# EAGLE schematic schematic3 (EAGLE 7.6.0)
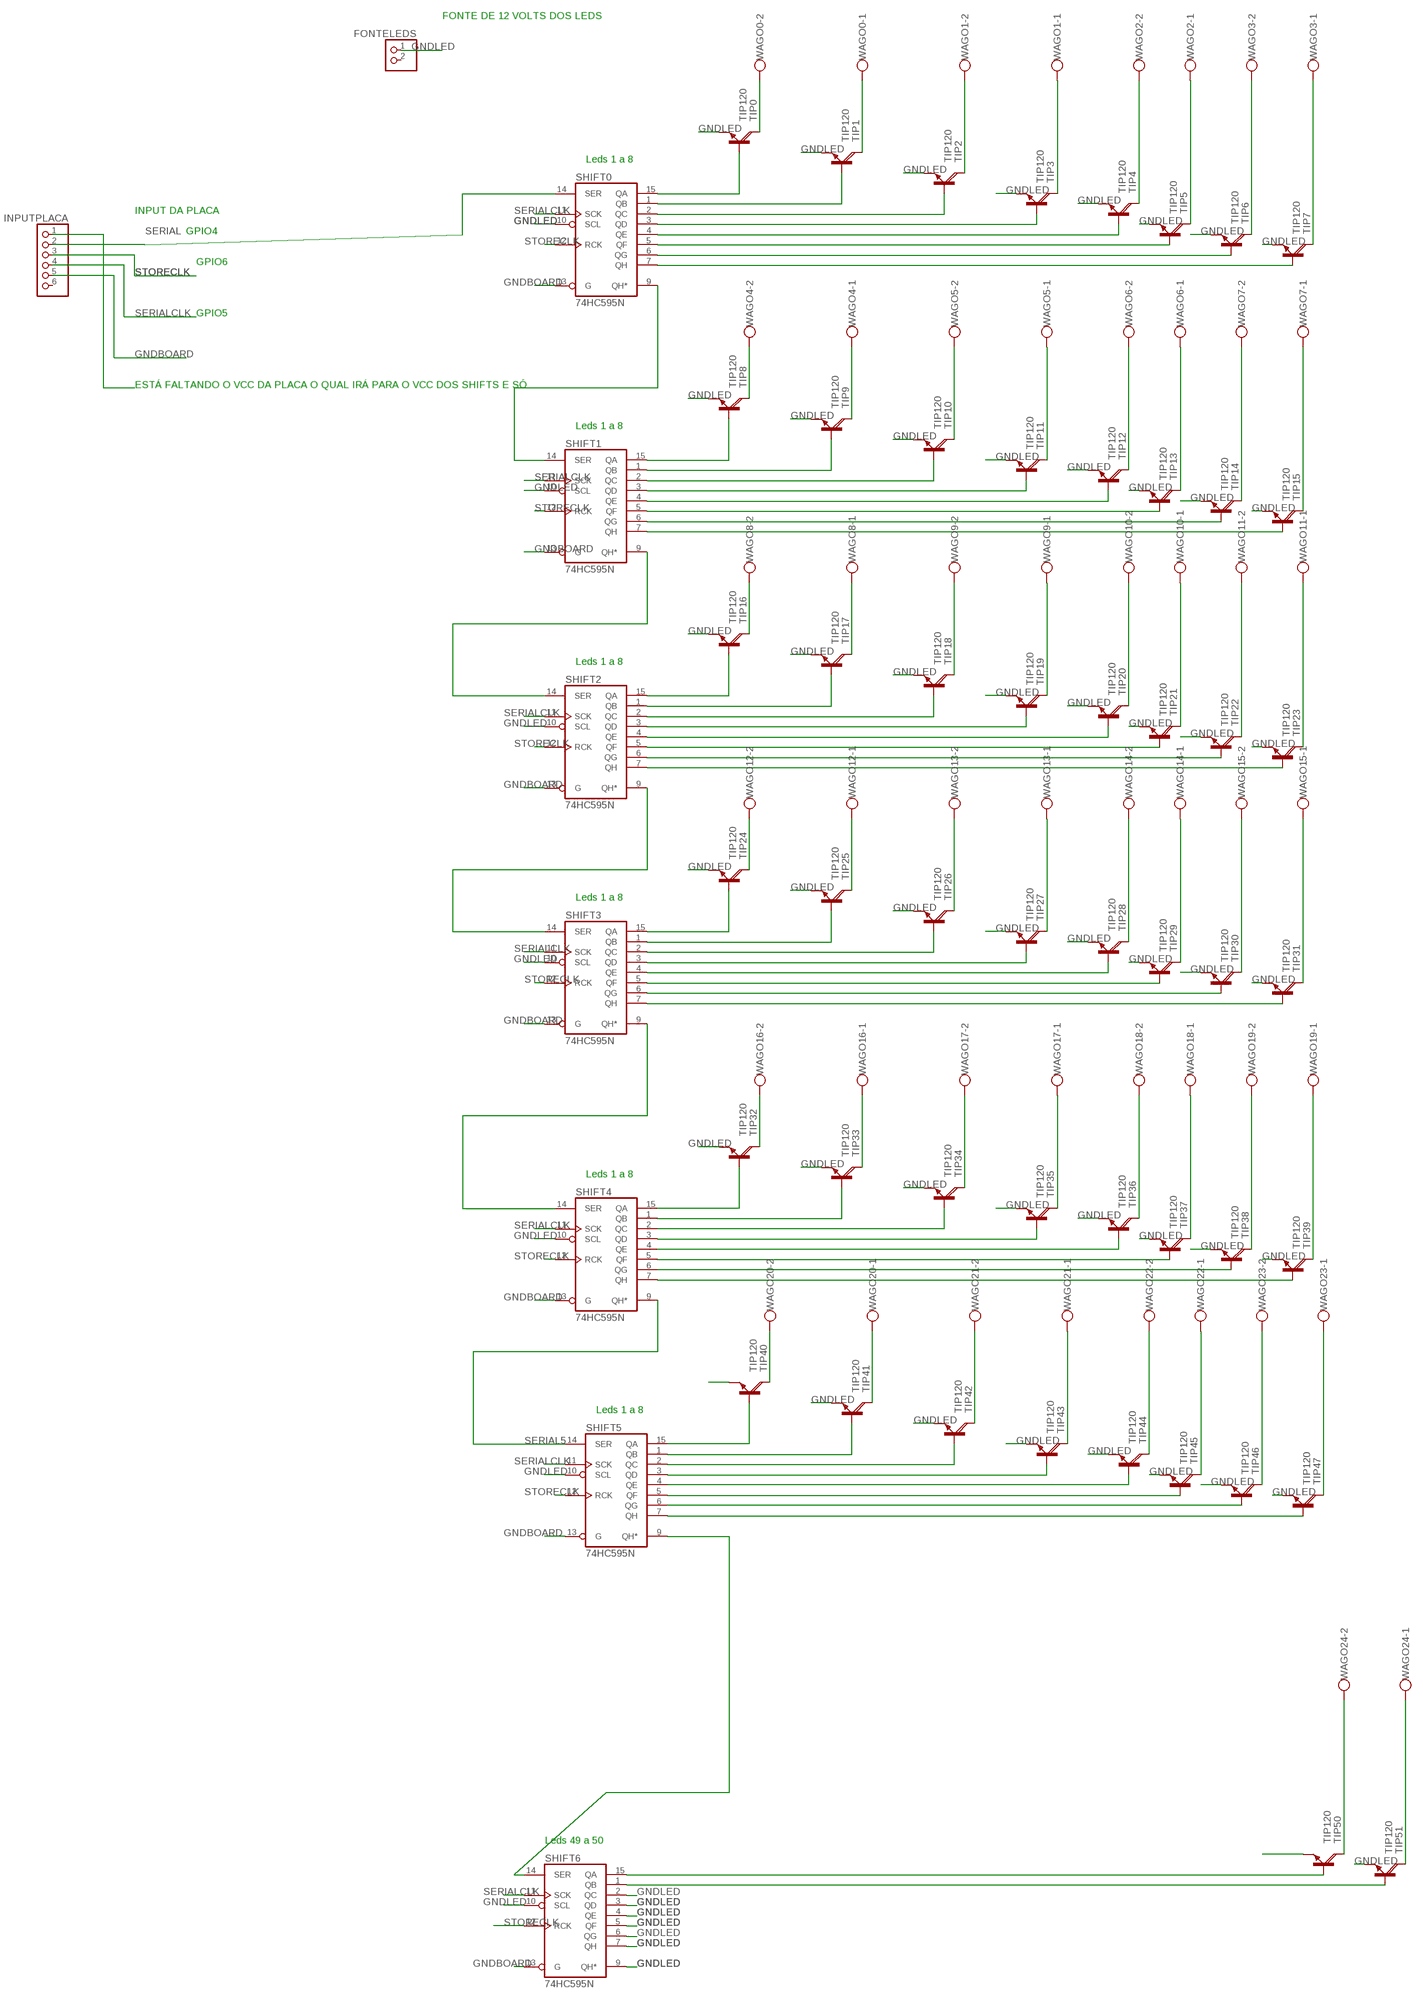
[diagram p0: schematic, sheet 1]

## Parts
FONTELEDS  PINHD-1X2  [1X02]
INPUTPLACA  PINHD-1X6  [1X06]
SHIFT0  74HC595N  [DIL16]
SHIFT1  74HC595N  [DIL16]
SHIFT2  74HC595N  [DIL16]
SHIFT3  74HC595N  [DIL16]
SHIFT4  74HC595N  [DIL16]
SHIFT5  74HC595N  [DIL16]
SHIFT6  74HC595N  [DIL16]
TIP0  TIP120  [TO220AH]
TIP1  TIP120  [TO220AH]
TIP2  TIP120  [TO220AH]
TIP3  TIP120  [TO220AH]
TIP4  TIP120  [TO220AH]
TIP5  TIP120  [TO220AH]
TIP6  TIP120  [TO220AH]
TIP7  TIP120  [TO220AH]
TIP8  TIP120  [TO220AH]
TIP9  TIP120  [TO220AH]
TIP10  TIP120  [TO220AH]
TIP11  TIP120  [TO220AH]
TIP12  TIP120  [TO220AH]
TIP13  TIP120  [TO220AH]
TIP14  TIP120  [TO220AH]
TIP15  TIP120  [TO220AH]
TIP16  TIP120  [TO220AH]
TIP17  TIP120  [TO220AH]
TIP18  TIP120  [TO220AH]
TIP19  TIP120  [TO220AH]
TIP20  TIP120  [TO220AH]
TIP21  TIP120  [TO220AH]
TIP22  TIP120  [TO220AH]
TIP23  TIP120  [TO220AH]
TIP24  TIP120  [TO220AH]
TIP25  TIP120  [TO220AH]
TIP26  TIP120  [TO220AH]
TIP27  TIP120  [TO220AH]
TIP28  TIP120  [TO220AH]
TIP29  TIP120  [TO220AH]
TIP30  TIP120  [TO220AH]
TIP31  TIP120  [TO220AH]
TIP32  TIP120  [TO220AH]
TIP33  TIP120  [TO220AH]
TIP34  TIP120  [TO220AH]
TIP35  TIP120  [TO220AH]
TIP36  TIP120  [TO220AH]
TIP37  TIP120  [TO220AH]
TIP38  TIP120  [TO220AH]
TIP39  TIP120  [TO220AH]
TIP40  TIP120  [TO220AH]
TIP41  TIP120  [TO220AH]
TIP42  TIP120  [TO220AH]
TIP43  TIP120  [TO220AH]
TIP44  TIP120  [TO220AH]
TIP45  TIP120  [TO220AH]
TIP46  TIP120  [TO220AH]
TIP47  TIP120  [TO220AH]
TIP50  TIP120  [TO220AH]
TIP51  TIP120  [TO220AH]
WAGO0  W237-102  [W237-102]
WAGO1  W237-102  [W237-102]
WAGO2  W237-102  [W237-102]
WAGO3  W237-102  [W237-102]
WAGO4  W237-102  [W237-102]
WAGO5  W237-102  [W237-102]
WAGO6  W237-102  [W237-102]
WAGO7  W237-102  [W237-102]
WAGO8  W237-102  [W237-102]
WAGO9  W237-102  [W237-102]
WAGO10  W237-102  [W237-102]
WAGO11  W237-102  [W237-102]
WAGO12  W237-102  [W237-102]
WAGO13  W237-102  [W237-102]
WAGO14  W237-102  [W237-102]
WAGO15  W237-102  [W237-102]
WAGO16  W237-102  [W237-102]
WAGO17  W237-102  [W237-102]
WAGO18  W237-102  [W237-102]
WAGO19  W237-102  [W237-102]
WAGO20  W237-102  [W237-102]
WAGO21  W237-102  [W237-102]
WAGO22  W237-102  [W237-102]
WAGO23  W237-102  [W237-102]
WAGO24  W237-102  [W237-102]

## Nets
GNDBOARD: INPUTPLACA.5 SHIFT0.13(G) SHIFT1.13(G) SHIFT2.13(G) SHIFT3.13(G) SHIFT4.13(G) SHIFT5.13(G) SHIFT6.13(G)
GNDLED: FONTELEDS.1 SHIFT0.10(SCL) SHIFT1.10(SCL) SHIFT2.10(SCL) SHIFT3.10(SCL) SHIFT4.10(SCL) SHIFT5.10(SCL) SHIFT6.2(QC) SHIFT6.3(QD) SHIFT6.4(QE) SHIFT6.5(QF) SHIFT6.6(QG) SHIFT6.7(QH) SHIFT6.9(QH*) SHIFT6.10(SCL) TIP0.E TIP1.E TIP2.E TIP3.E TIP4.E TIP5.E TIP6.E TIP7.E TIP8.E TIP9.E TIP10.E TIP11.E TIP12.E TIP13.E TIP14.E TIP15.E TIP16.E TIP17.E TIP18.E TIP19.E TIP20.E TIP21.E TIP22.E TIP23.E TIP24.E TIP25.E TIP26.E TIP27.E TIP28.E TIP29.E TIP30.E TIP31.E TIP32.E TIP33.E TIP34.E TIP35.E TIP36.E TIP37.E TIP38.E TIP39.E TIP40.E TIP41.E TIP42.E TIP43.E TIP44.E TIP45.E TIP46.E TIP47.E TIP50.E TIP51.E
N$1: SHIFT0.15(QA) TIP0.B
N$2: SHIFT0.1(QB) TIP1.B
N$3: SHIFT0.2(QC) TIP2.B
N$4: SHIFT0.3(QD) TIP3.B
N$5: SHIFT0.4(QE) TIP4.B
N$6: SHIFT0.5(QF) TIP5.B
N$7: SHIFT0.6(QG) TIP6.B
N$8: SHIFT0.7(QH) TIP7.B
N$9: SHIFT1.15(QA) TIP8.B
N$10: SHIFT1.1(QB) TIP9.B
N$11: SHIFT6.15(QA) TIP50.B
N$12: SHIFT1.2(QC) TIP10.B
N$13: SHIFT4.5(QF) TIP37.B
N$14: SHIFT1.3(QD) TIP11.B
N$15: SHIFT1.4(QE) TIP12.B
N$16: SHIFT4.6(QG) TIP38.B
N$17: SHIFT1.5(QF) TIP13.B
N$18: SHIFT4.7(QH) TIP39.B
N$19: SHIFT1.6(QG) TIP14.B
N$20: SHIFT5.5(QF) TIP45.B
N$21: SHIFT1.7(QH) TIP15.B
N$22: TIP8.C WAGO4.2
N$23: TIP9.C WAGO4.1
N$24: TIP10.C WAGO5.2
N$25: TIP11.C WAGO5.1
N$26: TIP12.C WAGO6.2
N$27: TIP13.C WAGO6.1
N$28: TIP14.C WAGO7.2
N$29: TIP15.C WAGO7.1
N$30: SHIFT2.15(QA) TIP16.B
N$31: SHIFT2.1(QB) TIP17.B
N$32: SHIFT2.2(QC) TIP18.B
N$33: SHIFT2.3(QD) TIP19.B
N$34: SHIFT2.4(QE) TIP20.B
N$35: SHIFT2.5(QF) TIP21.B
N$36: SHIFT2.6(QG) TIP22.B
N$37: SHIFT2.7(QH) TIP23.B
N$38: TIP16.C WAGO8.2
N$39: TIP17.C WAGO8.1
N$40: TIP18.C WAGO9.2
N$41: TIP19.C WAGO9.1
N$42: TIP20.C WAGO10.2
N$43: TIP21.C WAGO10.1
N$44: SHIFT4.15(QA) TIP32.B
N$45: TIP23.C WAGO11.1
N$46: SHIFT3.15(QA) TIP24.B
N$47: SHIFT3.1(QB) TIP25.B
N$48: SHIFT3.2(QC) TIP26.B
N$49: SHIFT3.3(QD) TIP27.B
N$50: SHIFT3.4(QE) TIP28.B
N$51: SHIFT5.6(QG) TIP46.B
N$52: SHIFT5.7(QH) TIP47.B
N$53: TIP0.C WAGO0.2
N$54: SHIFT3.5(QF) TIP29.B
N$55: SHIFT3.6(QG) TIP30.B
N$56: SHIFT3.7(QH) TIP31.B
N$57: TIP24.C WAGO12.2
N$58: TIP25.C WAGO12.1
N$59: TIP26.C WAGO13.2
N$60: SHIFT4.1(QB) TIP33.B
N$61: SHIFT4.2(QC) TIP34.B
N$62: SHIFT5.9(QH*) SHIFT6.14(SER)
N$63: TIP29.C WAGO14.1
N$64: TIP30.C WAGO15.2
N$65: TIP31.C WAGO15.1
N$66: SHIFT4.3(QD) TIP35.B
N$67: SHIFT4.4(QE) TIP36.B
N$70: TIP1.C WAGO0.1
N$72: TIP2.C WAGO1.2
N$73: TIP32.C WAGO16.2
N$74: TIP3.C WAGO1.1
N$75: TIP33.C WAGO16.1
N$76: TIP34.C WAGO17.2
N$77: TIP37.C WAGO18.1
N$78: TIP38.C WAGO19.2
N$79: TIP39.C WAGO19.1
N$80: SHIFT5.15(QA) TIP40.B
N$81: SHIFT5.1(QB) TIP41.B
N$82: SHIFT5.2(QC) TIP42.B
N$83: SHIFT5.3(QD) TIP43.B
N$84: SHIFT5.4(QE) TIP44.B
N$88: TIP40.C WAGO20.2
N$89: TIP41.C WAGO20.1
N$90: TIP42.C WAGO21.2
N$91: TIP45.C WAGO22.1
N$92: TIP46.C WAGO23.2
N$93: TIP47.C WAGO23.1
N$96: TIP50.C WAGO24.2
N$97: TIP51.C WAGO24.1
N$99: SHIFT6.1(QB) TIP51.B
N$166: TIP4.C WAGO2.2
N$168: TIP5.C WAGO2.1
N$170: TIP6.C WAGO3.2
N$172: TIP7.C WAGO3.1
SERIAL: INPUTPLACA.2 SHIFT0.14(SER)
SERIAL1: SHIFT0.9(QH*) SHIFT1.14(SER)
SERIAL2: SHIFT1.9(QH*) SHIFT2.14(SER)
SERIAL3: SHIFT2.9(QH*) SHIFT3.14(SER)
SERIAL4: SHIFT3.9(QH*) SHIFT4.14(SER)
SERIAL5: SHIFT4.9(QH*) SHIFT5.14(SER)
SERIALCLK: INPUTPLACA.4 SHIFT0.11(SCK) SHIFT1.11(SCK) SHIFT2.11(SCK) SHIFT3.11(SCK) SHIFT4.11(SCK) SHIFT5.11(SCK) SHIFT6.11(SCK)
STORECLK: INPUTPLACA.3 SHIFT0.12(RCK) SHIFT1.12(RCK) SHIFT2.12(RCK) SHIFT3.12(RCK) SHIFT4.12(RCK) SHIFT5.12(RCK) SHIFT6.12(RCK)
VCC: INPUTPLACA.1
WAGO1: TIP35.C WAGO17.1
WAGO2: TIP36.C WAGO18.2
WAGO3: TIP43.C WAGO21.1
WAGO4: TIP44.C WAGO22.2
WAGO11: TIP22.C WAGO11.2
WAGO14: TIP27.C WAGO13.1
WAGO15: TIP28.C WAGO14.2
Unconnected: FONTELEDS.2 INPUTPLACA.6

## Notes on the sheet
- FONTE DE 12 VOLTS DOS LEDS
- Leds 1 a 8
- INPUT DA PLACA
- GPIO4
- GPIO6
- GPIO5
- ESTÁ FALTANDO O VCC DA PLACA O QUAL IRÁ PARA O VCC DOS SHIFTS E SÓ
- Leds 1 a 8
- Leds 1 a 8
- Leds 1 a 8
- Leds 1 a 8
- Leds 1 a 8
- Leds 49 a 50

## Power pins joined to a net without a drawn wire
GND: SHIFT0.8(GND) SHIFT1.8(GND) SHIFT2.8(GND) SHIFT3.8(GND) SHIFT4.8(GND) SHIFT5.8(GND) SHIFT6.8(GND)
VCC: SHIFT0.16(VCC) SHIFT1.16(VCC) SHIFT2.16(VCC) SHIFT3.16(VCC) SHIFT4.16(VCC) SHIFT5.16(VCC) SHIFT6.16(VCC)

## Library data of the parts
FONTELEDS = pinhead:PINHD-1X2: PIN HEADER
INPUTPLACA = pinhead:PINHD-1X6: PIN HEADER
SHIFT0 SHIFT1-SHIFT6 = 74xx-eu:74*595: 8-bit SHIFT REGISTER, output latch
TIP0 TIP1-TIP47 TIP50 TIP51 = transistor-power:TIP120: NPN DARLINGTON TRANSISTOR
WAGO0 WAGO1-WAGO24 = con-wago-500:W237-102: WAGO SCREW CLAMP; MPN: 237-102; OC_FARNELL: unknown; OC_NEWARK: 70K9898